# Altium schematic sheet TSSI.SchDoc: TSSI CIRCUIT
size 406 x 254 mm; Revision: 1; SheetNumber: 5; SheetTotal: 7
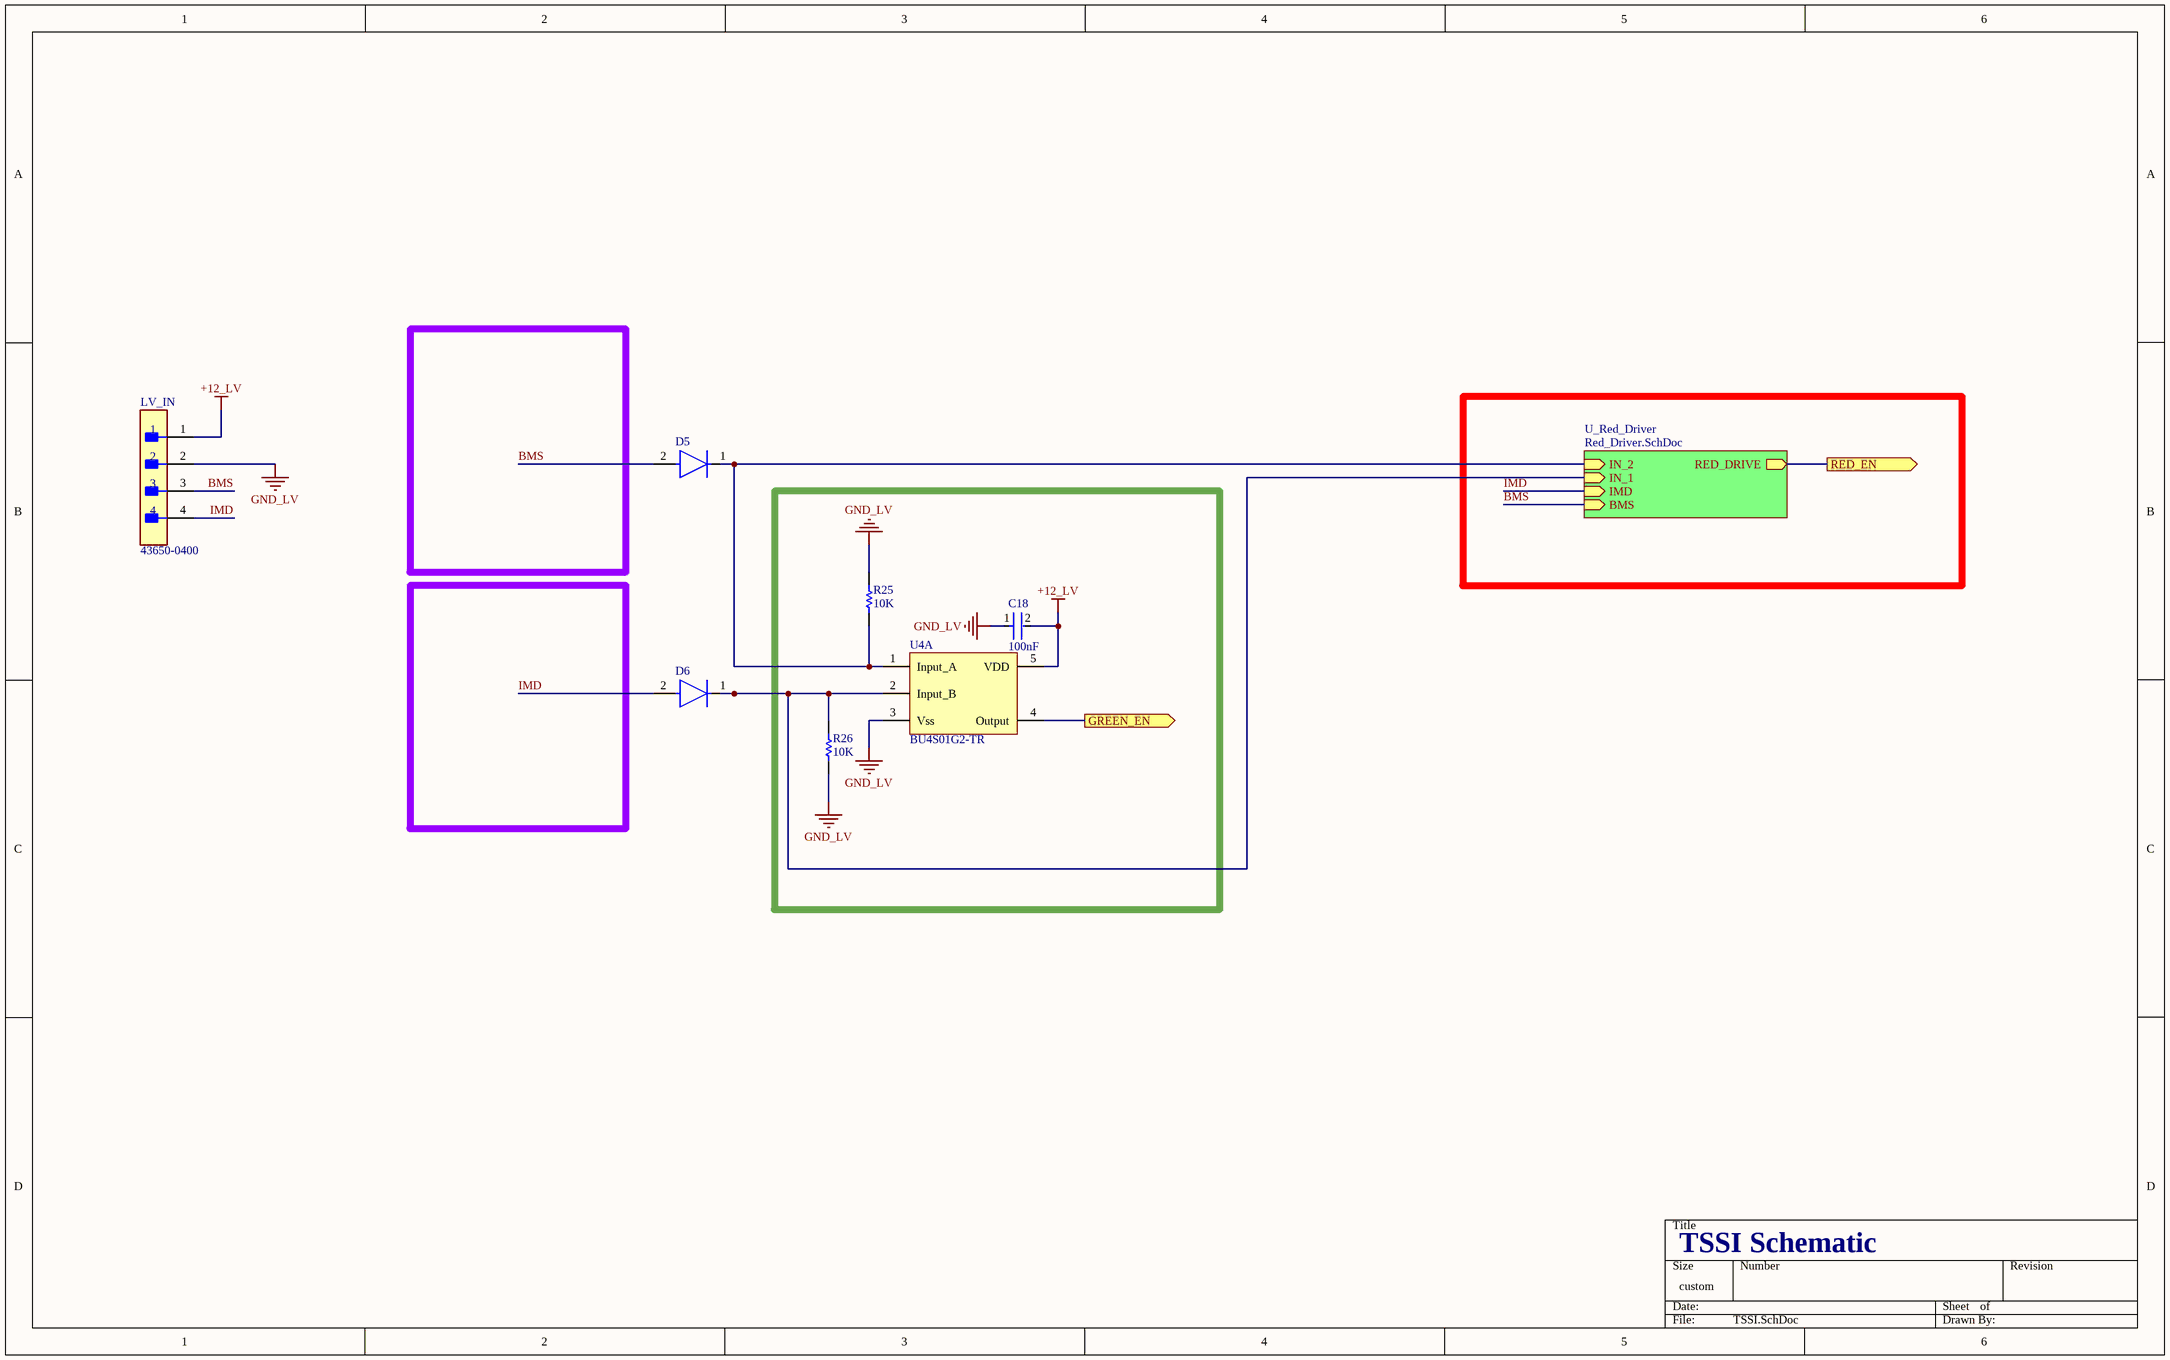
[diagram p0: TSSI.SchDoc]

## Parts
C18  100nF  [FP-C1206C-EB-MFG]
D5  DO-204AH_8_CENTRALSEMI_1  [FP-JANTXV1N486B-MFG]  (value not drawn)
D6  DO-204AH_8_CENTRALSEMI_1  [FP-JANTXV1N486B-MFG]  (value not drawn)
LV_IN  43650-0400  [FP-0436500400-MFG]
R25  10K  [R_1206_YAGEO_AC]
R26  10K  [R_1206_YAGEO_AC]
U4  BU4S01G2-TR  [SOT23__ROHM_SEMICONDUCTOR_TSZ02201]  (part A of 3)

## Sub-sheets
U_Red_Driver = Red_Driver.SchDoc: IN_2 (in), IN_1 (in), RED_DRIVE (out), IMD (in), BMS (in)

## Ports
GREEN_EN (out), RED_EN (out)

## Nets
+12_LV: C18.2 LV_IN.1 U4.5(VDD)
GND_LV: C18.1 LV_IN.2 R25.1 R26.2 U4.3(Vss)
BMS: D5.2(A) LV_IN.3 ; sheet U_Red_Driver/BMS
GREEN_EN: U4.4(Output) ; port GREEN_EN
IMD: D6.2(A) LV_IN.4 ; sheet U_Red_Driver/IMD
RED_EN: port RED_EN, sheet U_Red_Driver/RED_DRIVE
NetD5_1: D5.1(C) R25.2 U4.1(Input_A) ; sheet U_Red_Driver/IN_2
NetD6_1: D6.1(C) R26.1 U4.2(Input_B) ; sheet U_Red_Driver/IN_1

## Notes on the sheet
- TSSI Schematic

## Library data of the parts
C18 = CMP-03020-000153-1: CAP CER 0.1UF 100V X7R 1206; Manufacturer: KEMET; Manufacturer Part Number: C1206C104K1RACTU; Value: 0.10 μF; Tolerance: 0.1; Material: Ceramic; Temperature Coefficient: 15%; Automotive Grade: Grade 0; Voltage Rating: 100 V; Automotive: Yes; Ipc Land Pattern Name: CAPC320160X78; Device Class L1: Passive Components; ComponentLink2Description: Datasheet; Temperature Range Low: -55°C; Category: Cap; Octopart: https://octopart.com/c1206c104k1ractu-kemet-89521; Height: 0.88mm; Lead Free: Yes; Digikey Description: CAP CER 0.1UF 100V X7R 1206; Mouser Description: CAP CER 0.1UF 100V X7R 1206; Device Class L3: Ceramic Capacitors; Device Class L2: Capacitors; ComponentLink2URL: https://content.kemet.com/datasheets/KEM_C1007_X8R_ULTRA_150C_SMD.pdf; Temperature Range High: +150°C; Temperature Characteristic: X7R; RoHS: TRUE; Capacitance: 0.10 μF; Package: C1206C-EB; Temperature: -55°C to +150°C
D5 D6 = CMP-00002-1: Diode 250 V 200mA Through Hole DO-35; Max Inverse Voltage: 250 V; Forward Voltage: 1 V; Max Inverse Current: 50 nA; Forward Current: 100 mA; Max Operating Temperature: 200°C; Case/Package: DO-204AH; ComponentLink1Description: Datasheet
LV_IN = CMP-00257-00298074-1: 43650-0400 Connector Wire to Board Header 4 Position 3mm Solder Right Angle Thru-Hole Tray; NexarPartId: 298074; Manufacturer Lifecycle Status: ACTIVE; Glow Wire Compliant: Compliant; Voltage Rating (DC): 250V; Plating: Tin; Number of Circuits: 4; Voltage Rating: 600V; Gender: Male; Current Rating: 5A; Connector Type: Plug, Socket; Contact Resistance: 10mΩ; Height: 4.5mm; Schedule B: 8536694040, 8536694040; Housing Color: Black; Orientation: Right Angle, Vertical; Housing Material: Thermoplastic; Number of Rows: 1; Halogen Free: Low Halogen; Flammability Rating: UL94 V-0; Length: 14.86mm; REACH SVHC: Unknown; Number of Positions: 4; RoHS: Compliant; Number of Contacts: 4; Contact Material: Brass; Pitch: 3mm; Voltage Rating (AC): 250V; Number of Pins: 4; Termination: Solder; Country of Origin: US; Radiation Hardening: No; Lifecycle Status: Production; Color: Black; Contact Plating: Tin; Lead Pitch: 3mm; Max Voltage Rating (AC): 600V; Mount: Cable, Through Hole; Lead Free: Contains Lead; Max Operating Temperature: 105°C; Depth: 3.6mm; Min Operating Temperature: -40°C
R25 R26 = CMP-078-000543-1: RES SMD 10K OHM 1% 1/4W 1206; Manufacturer: YAGEO; Max Power: 0.25W, 1/4W; PN: AC1206FR-0710KL; Package: 1206 (3216 Metric); Tolerance: 1%; ComponentLink1Description: Datasheet; Max Operating Temperature: 155°C; Min Operating Temperature: -55°C; ComponentLink1URL: https://www.yageo.com/upload/media/product/productsearch/datasheet/rchip/PYu-AC_51_RoHS_L_9.pdf; Resistance Raw: 10k; Resistance: 10k
U4 = CMP-003-000051-1: NOR Gate IC 1 Channel 5-SSOP; Manufacturer: Rohm Semiconductor; Min Voltage Supply: -0.3; Max Input Voltage: V(supply); Min Input Voltage: 0; Max Voltage Supply: 18; Max Operating Temputare: 85°C; Min Operating Temputare: 40°C; PN: BU4S01G2-TR; Datasheet: https://fscdn.rohm.com/en/products/databook/datasheet/ic/logic_switch/standard_logic/bu4s01g2tr-e.pdf; PartId: 1